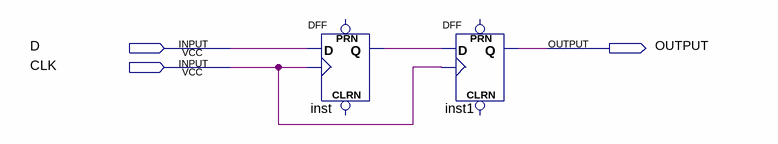
[diagram p0: schematic sheet]
// Quartus schematic FF_META.bdf as structural Verilog: 2 symbols, 3 pins
module FF_META (
  input  D,
  input  CLK,
  output OUTPUT
);

  wire inst_q;

  DFF inst (.CLK(CLK), .D(D), .Q(inst_q));  // open: CLRN, PRN
  DFF inst1 (.CLK(CLK), .D(inst_q), .Q(OUTPUT));  // open: CLRN, PRN
endmodule
